# Altium project CRD25DA12N-FMC V1-2 (01-2024).PrjPcb (part 1 of 8)
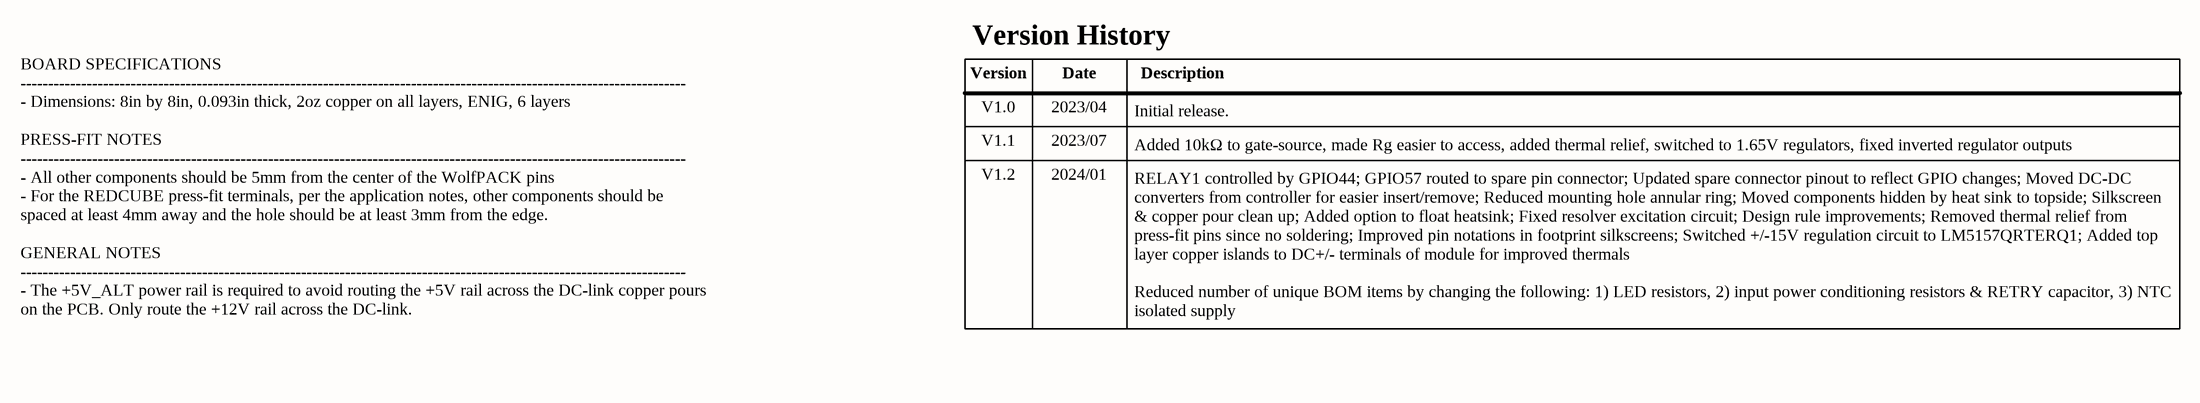
[diagram p0: 01 - Notes.SchDoc]
8 sheets, 574 parts. Net scope: global (net labels, ports and power ports of the same name join across sheets).
Board file: CRD25DA12N-FMC V1.2 (01-2024).PcbDoc
Sheets:
  01 - Notes.SchDoc
  02 - Power Stage.SchDoc
  03 - Controller.SchDoc
  04 - Auxiliary Power.SchDoc
  05 - Gate Drivers.SchDoc
  06 - Voltage Sense.SchDoc
  07 - Current Sense.SchDoc
  08 - Resolver.SchDoc

## Sheet 01 - Notes.SchDoc: 25kW WolfPACK FM3 Six-Pack Inverter
size 431 x 279 mm; Date: 01/2024; DocumentNumber: CRD25DA12N-FMC; Revision: 1.2; SheetNumber: 1; SheetTotal: 8; SheetSize: B

### Notes on the sheet
- Version History
- Version
- Date
- Description
- V1.0
- V1.1
- 2023/04
- 2023/07
- Initial release.
- Added 10kΩ to gate-source, made Rg easier to access, added thermal relief, switched to 1.65V regulators, fixed inverted regulator outputs
- V1.2
- 2024/01
- RELAY1 controlled by GPIO44; GPIO57 routed to spare pin connector; Updated spare connector pinout to reflect GPIO changes; Moved DC-DC converters from controller for easier insert/remove; Reduced mounting hole annular ring; Moved components hidden by heat sink to topside; Silkscreen & copper pour clean up; Added option to float heatsink; Fixed resolver excitation circuit; Design rule improvements; Removed thermal relief from press-fit pins since no soldering; Improved pin notations in footprint silkscreens; Switched +/-15V regulation circuit to LM5157QRTERQ1; Added top layer copper islands to DC+/- terminals of module for improved thermals
  Reduced number of unique BOM items by changing the following: 1) LED resistors, 2) input power conditioning resistors & RETRY capacitor, 3) NTC isolated supply
- BOARD SPECIFICATIONS
  -------------------------------------------------------------------------------------------------------------------------
  - Dimensions: 8in by 8in, 0.093in thick, 2oz copper on all layers, ENIG, 6 layers
  PRESS-FIT NOTES
  -------------------------------------------------------------------------------------------------------------------------
  - All other components should be 5mm from the center of the WolfPACK pins
  - For the REDCUBE press-fit terminals, per the application notes, other components should be spaced at least 4mm away and the hole should be at least 3mm from the edge.
  GENERAL NOTES
  -------------------------------------------------------------------------------------------------------------------------
  - The +5V_ALT power rail is required to avoid routing the +5V rail across the DC-link copper pours on the PCB. Only route the +12V rail across the DC-link.
- Title:
- Date:
- Drawing No:
- Size:
- Revision:
- Sheet:
- of

## Sheet 02 - Power Stage.SchDoc: Power Stage - 25kW WolfPACK FM3 Six-Pack Inv.
size 431 x 279 mm; Date: 01/2024; DocumentNumber: CRD25DA12N-FMC; Revision: 1.2; SheetNumber: 2; SheetTotal: 8; SheetSize: B
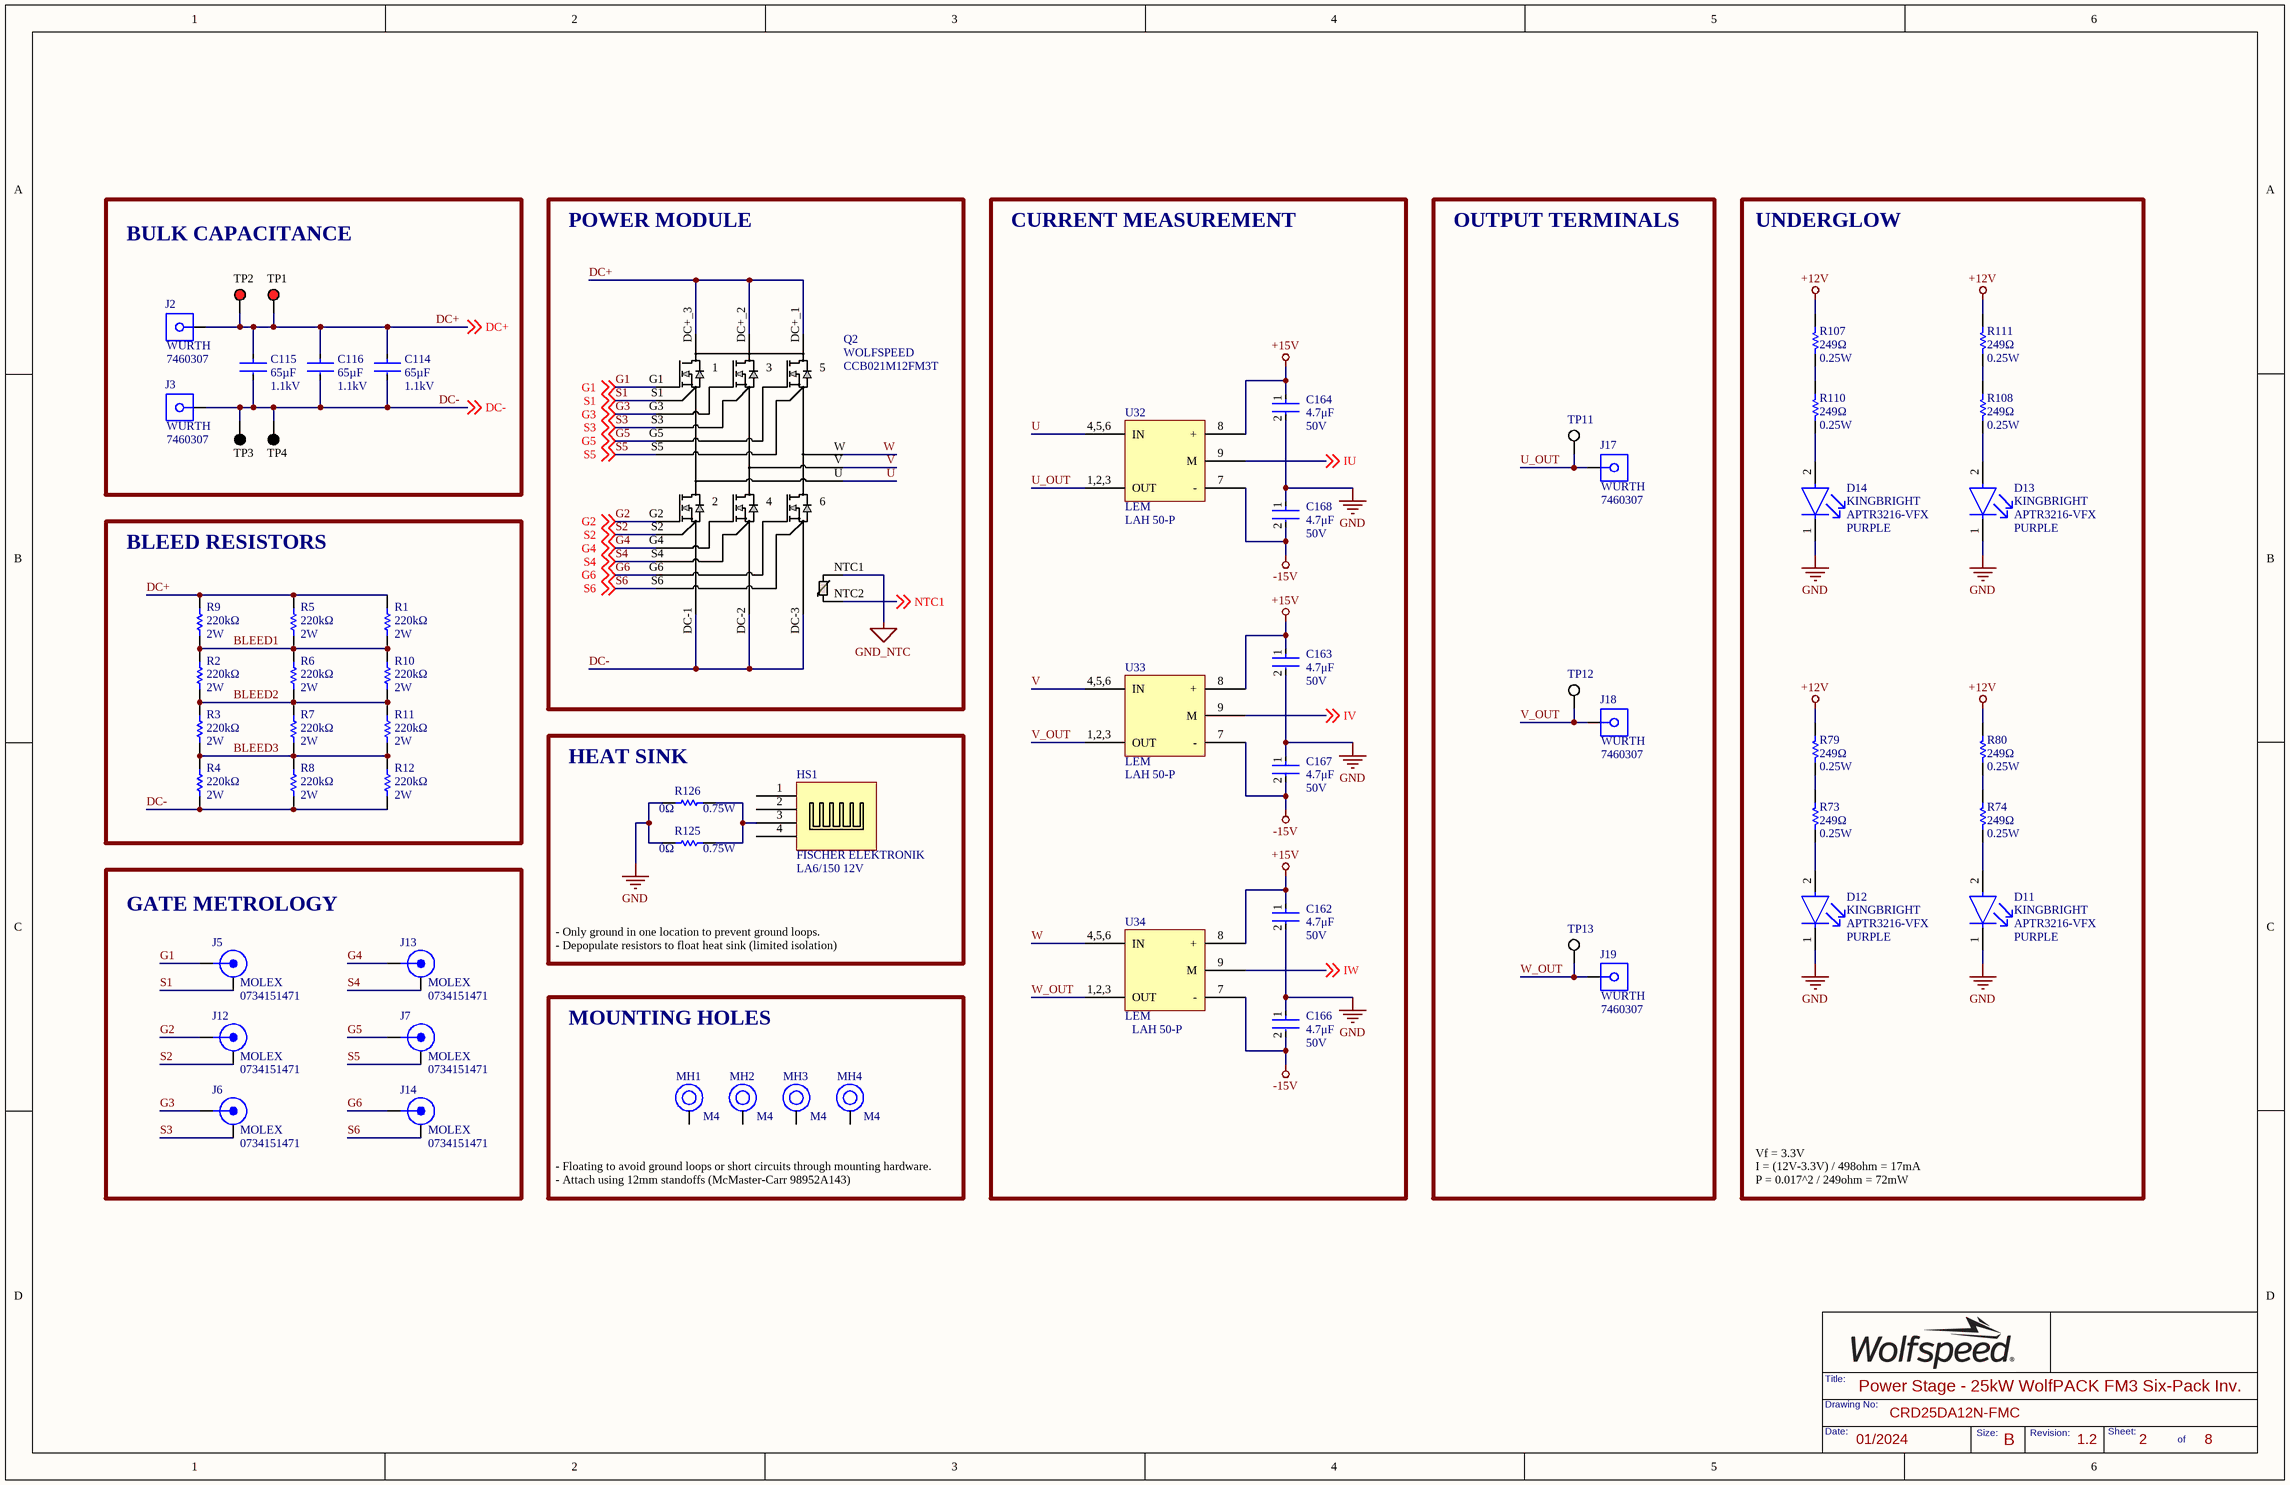
[diagram p1: 02 - Power Stage.SchDoc]

### Parts
C114  Voltage: 1.1kV  Capacitance: 65µF  [C4AQQEW5650A3BJ]  (hidden comment: C4AQQEW5650A3BJ)
C115  Voltage: 1.1kV  Capacitance: 65µF  [C4AQQEW5650A3BJ]  (hidden comment: C4AQQEW5650A3BJ)
C116  Voltage: 1.1kV  Capacitance: 65µF  [C4AQQEW5650A3BJ]  (hidden comment: C4AQQEW5650A3BJ)
C162  Voltage Rating: 50V  Capacitance: 4.7μF  [FP-CL31-IPC_C]  (hidden comment: CL31B475KBHNFNE)
C163  Voltage Rating: 50V  Capacitance: 4.7μF  [FP-CL31-IPC_C]  (hidden comment: CL31B475KBHNFNE)
C164  Voltage Rating: 50V  Capacitance: 4.7μF  [FP-CL31-IPC_C]  (hidden comment: CL31B475KBHNFNE)
C166  Voltage Rating: 50V  Capacitance: 4.7μF  [FP-CL31-IPC_C]  (hidden comment: CL31B475KBHNFNE)
C167  Voltage Rating: 50V  Capacitance: 4.7μF  [FP-CL31-IPC_C]  (hidden comment: CL31B475KBHNFNE)
C168  Voltage Rating: 50V  Capacitance: 4.7μF  [FP-CL31-IPC_C]  (hidden comment: CL31B475KBHNFNE)
D11  Manufacturer Print: KINGBRIGHT  Color: PURPLE  [FP-APTR3216SECK-MFG]  (hidden comment: APTR3216-VFX)
D12  Manufacturer: KINGBRIGHT  Color: PURPLE  [FP-APTR3216SECK-MFG]  (hidden comment: APTR3216-VFX)
D13  Manufacturer Print: KINGBRIGHT  Color: PURPLE  [FP-APTR3216SECK-MFG]  (hidden comment: APTR3216-VFX)
D14  Manufacturer Print: KINGBRIGHT  Color: PURPLE  [FP-APTR3216SECK-MFG]  (hidden comment: APTR3216-VFX)
HS1  LA6/150 12V  Manufacturer: FISCHER ELEKTRONIK  [LA 6 150 12]
J2  Manufacturer Print: WURTH  [7460307]  (hidden comment: 7460307)
J3  Manufacturer Print: WURTH  [7460307]  (hidden comment: 7460307)
J5  0734151471  Manufacturer Print: MOLEX  [FP-73415-1471-MFG]
J6  0734151471  Manufacturer Print: MOLEX  [FP-73415-1471-MFG]
J7  0734151471  Manufacturer Print: MOLEX  [FP-73415-1471-MFG]
J12  0734151471  Manufacturer Print: MOLEX  [FP-73415-1471-MFG]
J13  0734151471  Manufacturer Print: MOLEX  [FP-73415-1471-MFG]
J14  0734151471  Manufacturer Print: MOLEX  [FP-73415-1471-MFG]
J17  Manufacturer Print: WURTH  [7460307]  (hidden comment: 7460307)
J18  Manufacturer Print: WURTH  [7460307]  (hidden comment: 7460307)
J19  Manufacturer Print: WURTH  [7460307]  (hidden comment: 7460307)
MH1  Size: M4  [MH_M4_P]  (hidden comment: MH_M4_P)
MH2  Size: M4  [MH_M4_P]  (hidden comment: MH_M4_P)
MH3  Size: M4  [MH_M4_P]  (hidden comment: MH_M4_P)
MH4  Size: M4  [MH_M4_P]  (hidden comment: MH_M4_P)
Q2  CCB021M12FM3T  Manufacturer Print: WOLFSPEED  [FM3_SIX-PACK_3PHASE_CRW]
R1  Power Rating: 2W  Resistance: 220kΩ  [FP-CRGP2512-IPC_C]  (hidden comment: CRGP2512F220K)
R2  Power Rating: 2W  Resistance: 220kΩ  [FP-CRGP2512-IPC_C]  (hidden comment: CRGP2512F220K)
R3  Power Rating: 2W  Resistance: 220kΩ  [FP-CRGP2512-IPC_C]  (hidden comment: CRGP2512F220K)
R4  Power Rating: 2W  Resistance: 220kΩ  [FP-CRGP2512-IPC_C]  (hidden comment: CRGP2512F220K)
R5  Power Rating: 2W  Resistance: 220kΩ  [FP-CRGP2512-IPC_C]  (hidden comment: CRGP2512F220K)
R6  Power Rating: 2W  Resistance: 220kΩ  [FP-CRGP2512-IPC_C]  (hidden comment: CRGP2512F220K)
R7  Power Rating: 2W  Resistance: 220kΩ  [FP-CRGP2512-IPC_C]  (hidden comment: CRGP2512F220K)
R8  Power Rating: 2W  Resistance: 220kΩ  [FP-CRGP2512-IPC_C]  (hidden comment: CRGP2512F220K)
R9  Power Rating: 2W  Resistance: 220kΩ  [FP-CRGP2512-IPC_C]  (hidden comment: CRGP2512F220K)
R10  Power Rating: 2W  Resistance: 220kΩ  [FP-CRGP2512-IPC_C]  (hidden comment: CRGP2512F220K)
R11  Power Rating: 2W  Resistance: 220kΩ  [FP-CRGP2512-IPC_C]  (hidden comment: CRGP2512F220K)
R12  Power Rating: 2W  Resistance: 220kΩ  [FP-CRGP2512-IPC_C]  (hidden comment: CRGP2512F220K)
R73  Resistance: 249Ω  Power Rating: 0.25W  [FP-MCR18-IPC_A]  (hidden comment: RC1206FR-07249RL)
R74  Resistance: 249Ω  Power Rating: 0.25W  [FP-MCR18-IPC_A]  (hidden comment: RC1206FR-07249RL)
R79  Resistance: 249Ω  Power Rating: 0.25W  [FP-MCR18-IPC_A]  (hidden comment: RC1206FR-07249RL)
R80  Resistance: 249Ω  Power Rating: 0.25W  [FP-MCR18-IPC_A]  (hidden comment: RC1206FR-07249RL)
R107  Resistance: 249Ω  Power Rating: 0.25W  [FP-MCR18-IPC_A]  (hidden comment: RC1206FR-07249RL)
R108  Resistance: 249Ω  Power Rating: 0.25W  [FP-MCR18-IPC_A]  (hidden comment: RC1206FR-07249RL)
R110  Resistance: 249Ω  Power Rating: 0.25W  [FP-MCR18-IPC_A]  (hidden comment: RC1206FR-07249RL)
R111  Resistance: 249Ω  Power Rating: 0.25W  [FP-MCR18-IPC_A]  (hidden comment: RC1206FR-07249RL)
R125  value 0Ω  Power Rating: 0.75W  [RESC3125X70X40NL20T20]  (hidden comment: CRCW12100000Z0EAHP)
R126  value 0Ω  Power Rating: 0.75W  [RESC3125X70X40NL20T20]  (hidden comment: CRCW12100000Z0EAHP)
TP1  5010  [KSTN-5010_V]  (value not drawn)
TP2  5010  [KSTN-5010_V]  (value not drawn)
TP3  5011  [KSTN-5011_V]  (value not drawn)
TP4  5011  [KSTN-5011_V]  (value not drawn)
TP11  5012  [KSTN-5012_V]  (value not drawn)
TP12  5012  [KSTN-5012_V]  (value not drawn)
TP13  5012  [KSTN-5012_V]  (value not drawn)
U32  LAH 50-P  Manufacturer Print: LEM  [LAH 50-P]
U33  LAH 50-P  Manufacturer Print: LEM  [LAH 50-P]
U34  LAH 50-P  Manufacturer Print: LEM  [LAH 50-P]

### Blocks framed on the sheet
BULK CAPACITANCE: C114-C116 J2 J3 TP1-TP4
POWER MODULE: Q2
CURRENT MEASUREMENT: C162-C164 C166-C168 U32-U34
OUTPUT TERMINALS: J17-J19 TP11-TP13
UNDERGLOW: D11-D14 R73 R74 R79 R80 R107 R108 R110 R111
BLEED RESISTORS: R1-R12
HEAT SINK: HS1 R125 R126
GATE METROLOGY: J5-J7 J12-J14
MOUNTING HOLES: MH1-MH4

### Nets
+12V: R79.1 R80.1 R107.1 R111.1
+15V: C162.1 C163.1 C164.1 U32.8(+) U33.8(+) U34.8(+)
-15V: C166.2 C167.2 C168.2 U32.7(-) U33.7(-) U34.7(-)
GND: C162.2 C163.2 C164.2 C166.1 C167.1 C168.1 D11.1(C) D12.1(C) D13.1(C) D14.1(C) R125.1 R126.1
GND_NTC: Q2.NTC1
BLEED1: R1.1 R2.2 R5.1 R6.2 R9.1 R10.2
BLEED2: R2.1 R3.2 R6.1 R7.2 R10.1 R11.2
BLEED3: R3.1 R4.2 R7.1 R8.2 R11.1 R12.2
DC+: C114.1,2(+) C115.1,2(+) C116.1,2(+) J2.1,2,3,4,5,6,7,8 Q2.DC+_1 Q2.DC+_2 Q2.DC+_3 R1.2 R5.2 R9.2 TP1.1 TP2.1 ; off-sheet DC+
DC-: C114.3,4 C115.3,4 C116.3,4 J3.1,2,3,4,5,6,7,8 Q2.DC-1 Q2.DC-2 Q2.DC-3 R4.1 R8.1 R12.1 TP3.1 TP4.1 ; off-sheet DC-
G1: J5.1(CENTER) Q2.G1 ; off-sheet G1
G2: J12.1(CENTER) Q2.G2 ; off-sheet G2
G3: J6.1(CENTER) Q2.G3 ; off-sheet G3
G4: J13.1(CENTER) Q2.G4 ; off-sheet G4
G5: J7.1(CENTER) Q2.G5 ; off-sheet G5
G6: J14.1(CENTER) Q2.G6 ; off-sheet G6
IU: U32.9(M) ; off-sheet IU
IV: U33.9(M) ; off-sheet IV
IW: U34.9(M) ; off-sheet IW
NTC1: Q2.NTC2 ; off-sheet NTC1
S1: J5.2,3,4,5(SHIELD) Q2.S1 ; off-sheet S1
S2: J12.2,3,4,5(SHIELD) Q2.S2 ; off-sheet S2
S3: J6.2,3,4,5(SHIELD) Q2.S3 ; off-sheet S3
S4: J13.2,3,4,5(SHIELD) Q2.S4 ; off-sheet S4
S5: J7.2,3,4,5(SHIELD) Q2.S5 ; off-sheet S5
S6: J14.2,3,4,5(SHIELD) Q2.S6 ; off-sheet S6
U: Q2.U U32.4,5,6(IN)
U_OUT: J17.1,2,3,4,5,6,7,8 TP11.1 U32.1,2,3(OUT)
V: Q2.V U33.4,5,6(IN)
V_OUT: J18.1,2,3,4,5,6,7,8 TP12.1 U33.1,2,3(OUT)
W: Q2.W U34.4,5,6(IN)
W_OUT: J19.1,2,3,4,5,6,7,8 TP13.1 U34.1,2,3(OUT)
NetD11_2: D11.2(A) R74.2
NetD12_2: D12.2(A) R73.2
NetD13_2: D13.2(A) R108.2
NetD14_2: D14.2(A) R110.2
NetHS1_3: HS1.3 R125.2 R126.2
NetR73_1: R73.1 R79.2
NetR74_1: R74.1 R80.2
NetR107_2: R107.2 R110.1
NetR108_1: R108.1 R111.2

Not connected (* = marked no-connect by the designer): HS1 1 2 4; MH1 1; MH2 1; MH3 1; MH4 1

### Notes on the sheet
- - Only ground in one location to prevent ground loops.
  - Depopulate resistors to float heat sink (limited isolation)
- - Floating to avoid ground loops or short circuits through mounting hardware.
  - Attach using 12mm standoffs (McMaster-Carr 98952A143)
- Vf = 3.3V
  I = (12V-3.3V) / 498ohm = 17mA
  P = 0.017^2 / 249ohm = 72mW
- Title:
- Date:
- Drawing No:
- Size:
- Revision:
- Sheet:
- of
- (in symbol CCB021M12FM3) 1; 3; 5; 2; 4; 6

### Library data of the parts
C114-C116 = C4AQQEW5650A3BJ: CAP FILM 65UF 5% 1.1KVDC RAD; Manufacturer: KEMET; Value: 65µF; Supplier 1: Digi-Key; Manufacturer Part Number: C4AQQEW5650A3BJ; RoHS: Yes; Category: Film Capacitors; Stock 1: 1080; Pricing 1: 1=19.26000, 10=18.24800, 50=15.71360, 100=14.69980, 500=13.17910 (USD); RoHS Compliant: No; Supplier Part Number 1: 399-C4AQQEW5650A3BJ-ND; Package: RADIAL
C162-C164 C166-C168 = CMP-13271-001123-1: CAP CER 4.7UF 50V X7R 1206; Manufacturer: SAMSUNG; Tolerance: 10%; Value: 4.7μF; Depth: 1.6mm; Max Operating Temperature: 125°C; Case Code (Metric): 3216; Packaging: Tape and Reel; Mount: Surface Mount; Min Operating Temperature: -55°C; Thickness: 0.071inch; Package: 1206; Length: 3.2mm; Dielectric: X7R; Case Code (Imperial): 1206; Height: 1.6mm; Package Quantity: 1; Radiation Hardening: No; Width: 0.063inch; Manufacturer Part Number: CL31B475KBHNFNE
D11-D14 = APTR3216-VFX: LED PURPLE CLEAR 1206 SMD; Supplier 1: Mouser; RoHS: Yes; Category: LEDs; Stock 1: 19947; Pricing 1: 1=0.84000, 10=0.55000, 50=0.55000, 100=0.36100, 1000=0.28500, 10000=0.25200 (USD); RoHS Compliant: Yes; Supplier Part Number 1: 604-APTR3216-VFX; Manufacturer Part Number: APTR3216-VFX; Value: PURPLE; Package: 1206
  D11 D13 D14: Manufacturer: Kingbright
HS1 = LA 6 150 12: HEATSINK EXTRUSION 150MM; Natural Thermal Resistance: 0.175°C/W; Power Consumption: 2.9W; Supplier 1: Newark; Manufacturer Part Number: LA6/150 12V; RoHS: Yes; Category: Uncategorized; Stock 1: 135; Pricing 1: 1=128.57000, 10=109.67000, 25=105.17000, 50=100.26000, 100=91.40000, 250=79.15000 (USD); Weight: 66g; Material: Aluminium; Length: 150mm; Reach SVHC Compliant: Yes; ComponentLink1URL: https://datasheet.ciiva.com/14098/fmfischer-lufteraggregat-la6-en-14098709.pdf?src-supplier=Distrelec; ComponentLink1Description: https://datasheet.ciiva.com/14098/fmfischer-lufteraggregat-la6-en-14098709.pdf?src-supplier=Distrelec; ComponentLink2URL: https://datasheet.ciiva.com/1609/17634-1609751.pdf?src-supplier=Element14; ComponentLink2Description: https://datasheet.ciiva.com/1609/17634-1609751.pdf?src-supplier=Element14; Supplier Part Number 1: 42M1958; Package: N/A; Value: N/A
J2 J3 J17-J19 = 7460307: TERM REDCUBE M4 8PIN PCB; Manufacturer: WURTH ELEKTRONIK; Current Rating: 80A; Number of Contacts: 8; Insulation: Non-Insulated; Supplier 1: Rs; RoHS: Yes; Category: Terminals; Stock 1: 1875; Mount: Through Hole; Number of Pins: 8; Contact Material: Copper; Contact Plating: Tin; Min Operating Temperature: -40°C; Max Operating Temperature: 135°C; Packaging: Bulk; Package Quantity: 250; Number of Rows: 2; Termination: Press-Fit; Series: REDCUBE WP-BUTR; Length: 9mm; Width: 9mm; Height: 10.5mm; Thread Size: M4; RoHS Compliant: Yes; ComponentLink1URL: https://datasheet.ciiva.com/8043/1736661-8043578.pdf?src-supplier=Element14; ComponentLink1Description: https://datasheet.ciiva.com/8043/1736661-8043578.pdf?src-supplier=Element14; ComponentLink2URL: https://datasheet.ciiva.com/13538/powerelements20with20220row20pin20plate-13538549.pdf?src-supplier=Mouser; ComponentLink2Description: https://datasheet.ciiva.com/13538/powerelements20with20220row20pin20plate-13538549.pdf?src-supplier=Mouser; ComponentLink3URL: https://datasheet.ciiva.com/23814/606286-23814304.pdf?src-supplier=Newark; ComponentLink3Description: https://datasheet.ciiva.com/23814/606286-23814304.pdf?src-supplier=Newark; ComponentLink4URL: https://datasheet.ciiva.com/847/bushes-847081.pdf?src-supplier=Digi-Key; ComponentLink4Description: https://datasheet.ciiva.com/847/bushes-847081.pdf?src-supplier=Digi-Key; Supplier Part Number 1: 1224952; Manufacturer Part Number: 7460307; Value: N/A; Package: N/A
J5-J7 J12-J14 = 0734151471: CONN MMCX JACK STR 50 OHM PCB; Manufacturer Part Number: 73415-1471; Body Material: Brass; Body Plating: Gold; Impedance: 50R; Connector Type: PCB,MMCX,Coaxial; Max Frequency: 6GHz; Gender: Female; Supplier 1: Allied Electronics; Manufacturer: MOLEX; RoHS: Yes; Category: RF / Coaxial Connectors; Stock 1: 18; Pricing 1: 1=2.94000, 5=2.79000, 100=2.65000 (USD); Mount: Through Hole; Contact Material: Copper; Contact Plating: Gold; Insulation Material: Teflon; Plating: Gold; Packaging: Bulk; Package Quantity: 500; Termination: Solder; Orientation: Straight; Series: 73415; Operating Frequency: N/A; Length: 3.51mm; Depth: 3.51mm; Radiation Hardening: No; RoHS Compliant: Yes; Lead Free: Lead Free; Halogen Free: Low Halogen; Supplier Part Number 1: 70364031; Value: N/A; Package: N/A
MH1-MH4 = MH_M4_P: HEX STANDOFF M4 ALUMINUM 51MM F-F; Manufacturer: MCMASTER-CARR; Manufacturer Part Number: 95947A552; Package: N/A; Value: N/A
Q2 = CCB021M12FM3: SIC 6N-CH 1200V 30A MODULE; Mfr_Name: Cree Wolfspeed; Type: DEV; Copyright: Copyright (C) 2021 Ultra Librarian. All rights reserved.; Manufacturer_Part_Number: CCB021M12FM3; RefDes: RefDes; Supplier 1: Arrow Electronics; Manufacturer: WOLFSPEED; Manufacturer Part Number: CCB021M12FM3T; RoHS: No; Category: MOSFETs; Stock 1: 52; Pricing 1: 1=248.05500, 10=245.57100, 25=243.75400, 50=241.29300, 100=238.84350, 500=236.39400 (USD); Supplier Part Number 1: CCB021M12FM3; Package: FMC; Value: N/A
R1-R12 = CMP-03211-002966-1: RES 220K OHM 1% 2W 2512; Manufacturer: TE; Value: 220kΩ; Temperature Coefficient: ±100ppm/°C; Tolerance: 0.01; Voltage Rating: 500V; Device Class L1: Passive Components; RoHS: TRUE; ComponentLink2Description: Datasheet; Series: CRGP; ComponentLink2URL: https://www.mouser.ca/datasheet/2/418/NG_DS_9-1773463-9_A-1358566.pdf; Octopart: https://octopart.com/crgp2512f220k-te+connectivity-91019045; Height: 0.65mm; Composition: Thick Film; Ambient Temperature Range High: +70°C; Temperature Range High: +155°C; Automotive: No; Category: Res; Lead Free: Yes; Device Class L3: Chip SMD Resistors; Ipc Land Pattern Name: RESC635320X55; Temperature Range Low: -55°C; Manufacturer Part Number: CRGP2512F220K; Temperature: -55°C to +155°C; Device Class L2: Resistors; Package: 2512
R73 R74 R79 R80 R107 R108 R110 R111 = RC1206FR-07249RL: RES 249 OHM 1% 1/4W 1206; Manufacturer: YAGEO; Voltage Rating: 200V; Temperature Coefficient: 100ppm/°C; Max Power Dissipation: 250mW; Value: 249Ω; Supplier 1: Future Electronics; Manufacturer Part Number: RC1206FR-07249RL; RoHS: Yes; Category: Chip SMD Resistors; Stock 1: 560000; Pricing 1: 5000=0.00430, 25000=0.00410, 100000=0.00390, 250000=0.00370, 625000=0.00350 (USD); Package: 1206; Case Code (Imperial): 1206; Case Code (Metric): 3216; Size Code: 1206; Min Operating Temperature: -55°C; Max Operating Temperature: 155°C; Tolerance: 1%; Packaging: Tape and Reel; Termination: SMD/SMT; Resistor Type: Thick Film; Voltage Rating (DC): 200V; Features: Moisture Resistant; Series: RC; Number of Terminations: 2; Construction: Rectangular; Length: 3.1mm; Depth: 1.6mm; Military Standard: Not; Lead Free: Lead Free; RoHS Compliant: Yes; ComponentLink1URL: https://datasheet.ciiva.com/16747/pyu-rc1206-51-rohs-l-4-16747103.pdf?src-supplier=Future+Electronics; ComponentLink1Description: https://datasheet.ciiva.com/16747/pyu-rc1206-51-rohs-l-4-16747103.pdf?src-supplier=Future+Electronics; Supplier Part Number 1: 1142064
R125 R126 = CRCW12100000Z0EAHP: RES SMD 0 OHM JUMPER 3/4W 1210; Manufacturer: VISHAY DALE; Max Power Dissipation: 750mW; Supplier 1: Mouser; Manufacturer Part Number: CRCW12100000Z0EAHP; RoHS: Yes; Category: Chip SMD Resistors; Stock 1: 904; Pricing 1: 1=0.7, 10=0.535, 50=0.535, 100=0.225, 1000=0.135, 10000=0.134 (USD); Package: 1210; Weight: 0.000564oz; Case Code (Imperial): 1210; Case Code (Metric): 3225; Min Operating Temperature: -55°C; Max Operating Temperature: 155°C; Packaging: Tape and Reel; Package Quantity: 10; Resistance: 0Ω; Termination: SMD/SMT; Number of Terminations: 2; Features: Automotive AEC-Q200; Series: CRCW-HP; Length: 0.126inch; Width: 0.098inch; Height: 0.028inch; Radiation Hardening: No; Lead Free: Lead Free; RoHS Compliant: Yes; ComponentLink1URL: https://datasheet.ciiva.com/2477/crcwhpe3-2477993.pdf?src-supplier=Digi-Key; ComponentLink1Description: https://datasheet.ciiva.com/2477/crcwhpe3-2477993.pdf?src-supplier=Digi-Key; ComponentLink2URL: https://datasheet.ciiva.com/2477/crcwhpe3-2477991.pdf?src-supplier=Digi-Key; ComponentLink2Description: https://datasheet.ciiva.com/2477/crcwhpe3-2477991.pdf?src-supplier=Digi-Key; ComponentLink3URL: https://datasheet.ciiva.com/2477/crcwhpe3-2477992.pdf?src-supplier=Digi-Key; ComponentLink3Description: https://datasheet.ciiva.com/2477/crcwhpe3-2477992.pdf?src-supplier=Digi-Key; ComponentLink4URL: https://datasheet.ciiva.com/9109/crcwhpe3-9109997.pdf?src-supplier=Avnet; ComponentLink4Description: https://datasheet.ciiva.com/9109/crcwhpe3-9109997.pdf?src-supplier=Avnet; ComponentLink5URL: https://datasheet.ciiva.com/48527/crcwhpe3-48527662.pdf?src-supplier=Avnet; ComponentLink5Description: https://datasheet.ciiva.com/48527/crcwhpe3-48527662.pdf?src-supplier=Avnet; Supplier Part Number 1: 71-CRCW12100000Z0EAH
TP1 TP2 = CMP-1672-00002-4: PC TEST POINT MULTIPURPOSE RED; Manufacturer: KEYSTONE; Contact Material: Bronze; Mounting Technology: Through Hole; RoHSCompliant: true; Pins: 1; Package Quantity: 100; ComponentLink2Description: Datasheet; Height: 8.12 mm; ComponentLink1URL: http://www.keyelco.com/; DatasheetVersion: Rev. F, 12/2013; Mount: Through Hole; PackageReference: 5010; Contact Plating: Silver; Packaging: Bulk; Colour: Red; REACH SVHC: No SVHC; PackageDescription: 1-Pin Through Hole Device, Dia 3.17 mm; ComponentLink2URL: http://www.keyelco.com/product-pdf.cfm?p=1319; ComponentLink1Description: Manufacturer URL; Manufacturer Part Number: 5010; Value: RED; Package: N/A
TP3 TP4 = CMP-1672-00003-4: PC TEST POINT MULTIPURPOSE BLACK; Manufacturer: KEYSTONE; ComponentLink2URL: http://www.keyelco.com/product-pdf.cfm?p=1320; Colour: Black; Pins: 1; REACH SVHC: No SVHC; ComponentLink1URL: http://www.keyelco.com/; PackageReference: 5011; Contact Plating: Silver; Package Quantity: 100; Packaging: Bulk; RoHSCompliant: true; Height: 8.12 mm; PackageDescription: 1-Pin Through Hole Device, Dia 3.17 mm; Mount: Through Hole; Mounting Technology: Through Hole; DatasheetVersion: Rev. F, 12/2013; ComponentLink1Description: Manufacturer URL; Contact Material: Bronze; ComponentLink2Description: Datasheet; Manufacturer Part Number: 5011; Value: BLACK; Package: N/A
TP11-TP13 = CMP-1672-00004-4: PC TEST POINT MULTIPURPOSE WHITE; Manufacturer: KEYSTONE; DatasheetVersion: Rev. F, 12/2013; ComponentLink1URL: http://www.keyelco.com/; PackageReference: 5012; RoHSCompliant: true; ComponentLink2Description: Datasheet; Colour: White; Contact Material: Bronze; PackageDescription: 1-Pin Through Hole Device, Dia 3.17 mm; Mounting Technology: Through Hole; Mount: Through Hole; Package Quantity: 100; ComponentLink1Description: Manufacturer URL; Pins: 1; Height: 8.12 mm; Packaging: Bulk; REACH SVHC: No SVHC; Contact Plating: Silver; Length: 11.3 mm; ComponentLink2URL: http://www.keyelco.com/product-pdf.cfm?p=1321; Value: WHITE; Package: N/A; Manufacturer Part Number: 5012
U32-U34 = LAH 50-P: SENSOR CURRENT HALL 50A AC/DC; Frequency: 200kHz; Number of Channels: 1; Response Time: 0.5us; Max Supply Current: 35mA; Polarity: Bidirectional; Linearity: 0.15%; Accuracy: 0.25%; Operating Supply Voltage: 15V; Secondary Current: 25mA; Overall Height: 21mm; Overall Depth: 14.93mm; Supplier 1: Newark; Manufacturer: LEM; Manufacturer Part Number: LAH 50-P; RoHS: Yes; Category: Current Sensors; Stock 1: 776; Pricing 1: 1=22.98000, 10=21.60000, 25=20.67000 (USD); Mount: Through Hole,PCB; Case/Package: Module; Min Operating Temperature: -25°C; Max Operating Temperature: 85°C; Package Quantity: 12; Packaging: Bulk; Current Sensing: 50A; Series: LAH; Current Rating: 50A; Width: 33.3mm; Height: 21mm; RoHS Compliant: Yes; Lead Free: Lead Free; Reach SVHC Compliant: Yes; ComponentLink1URL: https://datasheet.ciiva.com/2812/lah2050-p20e-2812498.pdf?src-supplier=Digi-Key; ComponentLink1Description: https://datasheet.ciiva.com/2812/lah2050-p20e-2812498.pdf?src-supplier=Digi-Key; ComponentLink2URL: https://datasheet.ciiva.com/3327/lah50p-eng-tds-3327447.pdf?src-supplier=Distrelec; ComponentLink2Description: https://datasheet.ciiva.com/3327/lah50p-eng-tds-3327447.pdf?src-supplier=Distrelec; Supplier Part Number 1: 44W8442; Value: N/A; Package: N/A